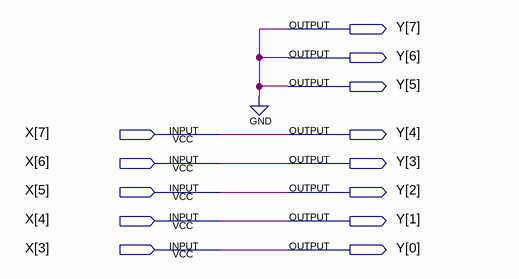
[diagram p0: schematic sheet]
// Quartus schematic Shifter3bit.bdf as structural Verilog: 0 symbols, 13 pins
module Shifter3bit (
  input  [7:3] X,
  output [7:0] Y
);


  assign Y = {3'b000, X};
endmodule
